# Altium schematic sheet CT310高端控制盒H区按键电路V1.0.SchDoc
size A4
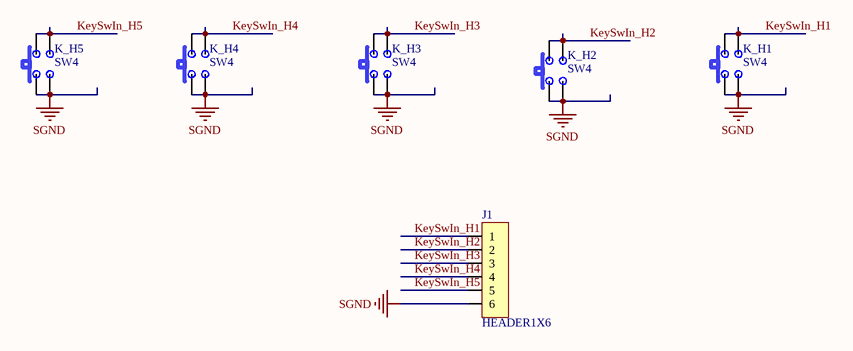
[diagram p0: CT310高端控制盒H区按键电路V1.0.SchDoc]

## Parts
J1  HEADER1X6  [ZH1X6WT-1.5]
K_H1  SW4  [SW-MEC]
K_H2  SW4  [SW-MEC]
K_H3  SW4  [SW-MEC]
K_H4  SW4  [SW-MEC]
K_H5  SW4  [SW-MEC]

## Nets
SGND: J1.6 K_H1.1 K_H2.1 K_H3.1 K_H4.1 K_H5.1
KeySwIn_H1: J1.1 K_H1.2
KeySwIn_H2: J1.2 K_H2.2
KeySwIn_H3: J1.3 K_H3.2
KeySwIn_H4: J1.4 K_H4.2
KeySwIn_H5: J1.5 K_H5.2

## Library data of the parts
K_H1-K_H5 = SW-key